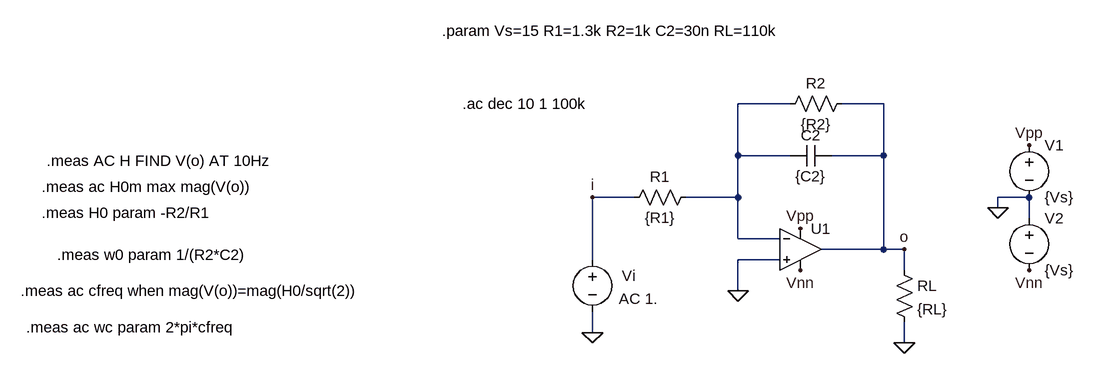
[diagram p0: schematic Filter01.asc]
Filter01.asc, the LTspice schematic file:
Version 4
SHEET 1 1220 680
WIRE 144 0 64 0
WIRE 288 0 224 0
WIRE 64 80 64 0
WIRE 144 80 64 80
WIRE 288 80 288 0
WIRE 288 80 208 80
WIRE -96 144 -160 144
WIRE 64 144 64 80
WIRE 64 144 -16 144
WIRE 512 144 464 144
WIRE 464 160 464 144
WIRE 512 176 512 144
WIRE 64 208 64 144
WIRE 128 208 64 208
WIRE 288 224 288 80
WIRE 288 224 192 224
WIRE 320 224 288 224
WIRE -160 240 -160 144
WIRE 128 240 64 240
WIRE 320 256 320 224
WIRE 64 288 64 240
WIRE -160 352 -160 320
WIRE 320 368 320 336
FLAG 512 64 Vpp
FLAG 464 160 0
FLAG 512 256 Vnn
FLAG 320 368 0
FLAG -160 352 0
FLAG 160 192 Vpp
FLAG 160 256 Vnn
FLAG 64 288 0
FLAG 320 224 o
FLAG -160 144 i
SYMBOL voltage 512 48 R0
WINDOW 123 0 0 Left 0
WINDOW 39 0 0 Left 0
SYMATTR InstName V1
SYMATTR Value {Vs}
SYMBOL voltage 512 160 R0
WINDOW 123 0 0 Left 0
WINDOW 39 0 0 Left 0
SYMATTR InstName V2
SYMATTR Value {Vs}
SYMBOL res 304 240 R0
SYMATTR InstName RL
SYMATTR Value {RL}
SYMBOL voltage -160 224 R0
WINDOW 3 41 76 Left 2
WINDOW 123 0 0 Left 0
WINDOW 39 0 0 Left 0
WINDOW 0 45 41 Left 2
SYMATTR Value AC 1.
SYMATTR InstName Vi
SYMBOL Opamps\\UniversalOpamp2 160 224 R0
SYMATTR InstName U1
SYMBOL cap 208 64 R90
WINDOW 0 0 32 VBottom 2
WINDOW 3 32 32 VTop 2
SYMATTR InstName C2
SYMATTR Value {C2}
SYMBOL res 0 128 R90
WINDOW 0 0 56 VBottom 2
WINDOW 3 32 56 VTop 2
SYMATTR InstName R1
SYMATTR Value {R1}
SYMBOL res 240 -16 R90
WINDOW 0 0 56 VBottom 2
WINDOW 3 32 56 VTop 2
SYMATTR InstName R2
SYMATTR Value {R2}
TEXT -392 -112 Left 2 !.param Vs=15 R1=1.3k R2=1k C2=30n RL=110k
TEXT -360 0 Left 2 !.ac dec 10 1 100k
TEXT -1000 88 Left 2 !.meas AC H FIND V(o) AT 10Hz
TEXT -1008 128 Left 2 !.meas ac H0m max mag(V(o))
TEXT -1008 168 Left 2 !.meas H0 param -R2/R1
TEXT -1040 288 Left 2 !.meas ac cfreq when mag(V(o))=mag(H0/sqrt(2))
TEXT -984 232 Left 2 !.meas w0 param 1/(R2*C2)
TEXT -1032 344 Left 2 !.meas ac wc param 2*pi*cfreq

The netlist it stands for:
* Filter01.asc
V1 Vpp 0 {Vs}
V2 0 Vnn {Vs}
RL o 0 {RL}
Vi i 0 AC 1.
XU1 0 N001 Vpp Vnn o level.2 Avol=1Meg GBW=10Meg Slew=10Meg ilimit=25m rail=0 Vos=0 phimargin=45 en=0 enk=0 in=0 ink=0 Rin=500Meg  ; pins IN+ IN- V+ V- OUT
C2 o N001 {C2}
R1 N001 i {R1}
R2 o N001 {R2}
.param Vs=15 R1=1.3k R2=1k C2=30n RL=110k
.ac dec 10 1 100k
.meas AC H FIND V(o) AT 10Hz
.meas ac H0m max mag(V(o))
.meas H0 param -R2/R1
.meas ac cfreq when mag(V(o))=mag(H0/sqrt(2))
.meas w0 param 1/(R2*C2)
.meas ac wc param 2*pi*cfreq
.lib UniversalOpamps2.sub
.backanno
.end